# EAGLE design BC5 (EAGLE 7.2.0)
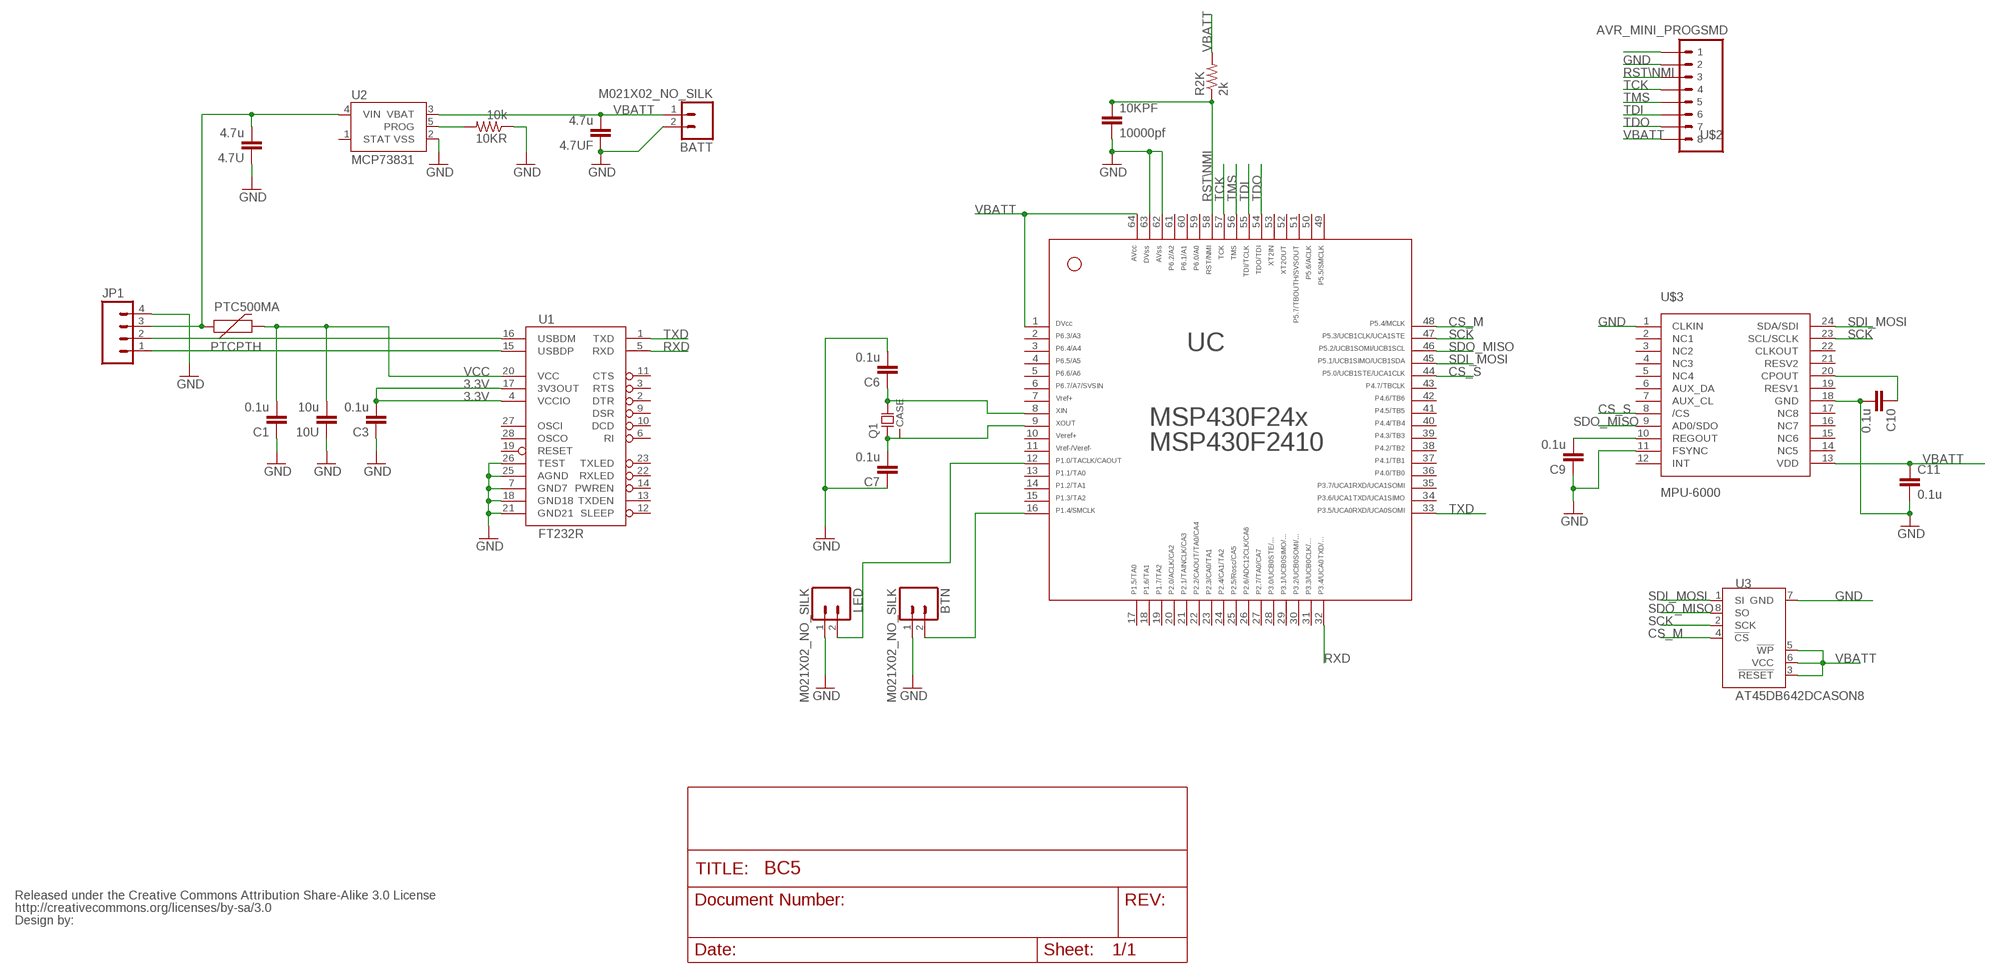
[diagram p0: schematic, sheet 1]

## Parts
4.7U  4.7u  CAP0402-CAP  [0402-CAP]
4.7UF  4.7u  CAP0402-CAP  [0402-CAP]
10KPF  10000pf  CAPEZ  [CAP-PTH-SMALLEZ]
10KR  10k  RESISTOR0402-RES  [0402-RES]
10U  10u  CAP0402-CAP  [0402-CAP]
BATT  M021X02_NO_SILK  [1X02_NO_SILK]
BTN  M021X02_NO_SILK  [1X02_NO_SILK]
C1  0.1u  CAP0402-CAP  [0402-CAP]
C3  0.1u  CAP0402-CAP  [0402-CAP]
C6  0.1u  CAP0402-CAP  [0402-CAP]
C7  0.1u  CAP0402-CAP  [0402-CAP]
C9  0.1u  CAP0402-CAP  [0402-CAP]
C10  0.1u  CAP0402-CAP  [0402-CAP]
C11  0.1u  CAP0402-CAP  [0402-CAP]
JP1  M04LOCK  [1X04_LOCK]
LED  M021X02_NO_SILK  [1X02_NO_SILK]
PTC500MA  PTCPTH  [PTC]
Q1  MS1V-T1K-32.768KHZ/12.5PF/20PPM/TA/QC  [MS1V-T1K]
R2K  2k  R-US_0204/5  [0204/5]
U1  FT232R  FT232RLSSOP  [SSOP28DB]
U2  MCP73831  [SOT23-5]
U3  AT45DB642DCASON8  [CASON8]
U$1  CREATIVE_COMMONS  [CREATIVE_COMMONS]
U$2  AVR_MINI_PROGSMD  [AVR_MINI_PROG]
U$3  MPU-6000  [QFN-24]
UC  F24[X/10]---PM64  [PM/PAG64]

## Nets
3.3V [power]: C3.2 U1.4(VCCIO) U1.17(3V3OUT)
5V: 4.7U.2 JP1.3 PTC500MA.P$1 U2.4(VIN)
BTN: BTN.2 UC.16
CS_M: U3.4(!CS) UC.48
CS_S: U$3.8(/CS) UC.44
GND [power]: 4.7U.1 4.7UF.1 10KPF.2 10KR.1 10U.1 BATT.2 BTN.1 C1.1 C3.1 C6.2 C7.1 C9.1 C10.2 C11.2 JP1.4 LED.1 U1.7(GND7) U1.18(GND18) U1.21(GND21) U1.25(AGND) U1.26(TEST) U2.2(VSS) U3.7(GND) U$2.2 U$3.1(CLKIN) U$3.11(FSYNC) U$3.18(GND) UC.62 UC.63
N$1: U$2.1
N$2: LED.2 UC.12
N$3: 10KR.2 U2.5(PROG)
N$4: C6.1 Q1.2 UC.8
N$5: C7.2 Q1.1 UC.9
N$6: C9.2 U$3.10(REGOUT)
N$7: C10.1 U$3.20(CPOUT)
RST\NMI: 10KPF.1 R2K.1 U$2.3 UC.58
RXD: U1.5(RXD) UC.32
SCK: U3.2(SCK) U$3.23(SCL/SCLK) UC.47
SDI_MOSI: U3.1(SI) U$3.24(SDA/SDI) UC.45
SDO_MISO: U3.8(SO) U$3.9(AD0/SDO) UC.46
TCK: U$2.4 UC.57
TDI: U$2.6 UC.55
TDO: U$2.7 UC.54
TMS: U$2.5 UC.56
TXD: U1.1(TXD) UC.33
USB_D+: JP1.1 U1.15(USBDP)
USB_D-: JP1.2 U1.16(USBDM)
VBATT: 4.7UF.2 BATT.1 C11.1 R2K.2 U2.3(VBAT) U3.3(!RESET) U3.5(!WP) U3.6(VCC) U$2.8 U$3.13(VDD) UC.1 UC.64
VCC [power]: 10U.2 C1.2 PTC500MA.P$2 U1.20(VCC)
Unconnected: Q1.CASE U1.2(DTR) U1.3(RTS) U1.6(RI) U1.9(DSR) U1.10(DCD) U1.11(CTS) U1.12(SLEEP) U1.13(TXDEN) U1.14(PWREN) U1.19(RESET) U1.22(RXLED) U1.23(TXLED) U1.27(OSCI) U1.28(OSCO) U2.1(STAT) U$3.2(NC1) U$3.3(NC2) U$3.4(NC3) U$3.5(NC4) U$3.6(AUX_DA) U$3.7(AUX_CL) U$3.12(INT) U$3.14(NC5) U$3.15(NC6) U$3.16(NC7) U$3.17(NC8) U$3.19(RESV1) U$3.21(RESV2) U$3.22(CLKOUT) UC.2 UC.3 UC.4 UC.5 UC.6 UC.7 UC.10 UC.11 UC.13 UC.14 UC.15 UC.17 UC.18 UC.19 UC.20 UC.21 UC.22 UC.23 UC.24 UC.25 UC.26 UC.27 UC.28 UC.29 UC.30 UC.31 UC.34 UC.35 UC.36 UC.37 UC.38 UC.39 UC.40 UC.41 UC.42 UC.43 UC.49 UC.50 UC.51 UC.52 UC.53 UC.59 UC.60 UC.61

## Library data of the parts
4.7U 4.7UF 10U C1 C3 C6 C7 C9-C11 = SparkFun-Capacitors:CAP: Capacitor Standard 0603 ceramic capacitor, and 0.1" leaded capacitor.
10KPF = SparkFun-Passives:CAP: Capacitor Standard 0603 ceramic capacitor, and 0.1" leaded capacitor.
10KR = SparkFun-Passives:RESISTOR: Resistor Basic schematic elements and footprints for 0603, 1206, and PTH resistors.
BATT BTN LED = SparkFun-Connectors:M02: Standard 2-pin 0.1" header. Use with - straight break away headers ( PRT-00116) - right angle break away headers (PRT-00553) - swiss pins (PRT-00743) - machine pins (PRT-00117) - female headers (PRT-00115) Molex polarized connector foot print use with: PRT-08233 with associated crimp pins and housings. 2.54_SCREWTERM for use with PRT-10571. 3.5mm Screw Terminal footprints for PRT-08084 5mm Screw Terminal footprints for use with PRT-08433
JP1 = SparkFun-Connectors:M04: Header 4 Standard 4-pin 0.1" header. Use with straight break away headers (SKU : PRT-00116), right angle break away headers (PRT-00553), swiss pins (PRT-00743), machine pins (PRT-00117), and female headers (PRT-00115). Molex polarized connector foot print use with SKU : PRT-08231 with associated crimp pins and housings. 1MM SMD Version SKU: PRT-10208
PTC500MA = SparkFun-PowerIC:PTC: Resettable Fuse PTC Resettable Fuse. Spark Fun Electronics SKU : COM-08357
Q1 = T1K:MS1V-T1K-*: p r e l i m i n a r y 5 . 0 . 0 MS1V-T1K Crystaly source: www.microcrystal.com
R2K = resistor:R-US_: RESISTOR, American symbol
U1 = SparkFun:FT232RL: USB UART FT232RL 4th Generation USB UART (USB <-> Serial) Controller. Spark Fun Electronics SKU : COM-00650
U2 = SparkFun-PowerIC:MCP73831: Miniature single cell, fully integrated Li-Ion, Li-polymer charge management controller http://ww1.microchip.com/downloads/en/DeviceDoc/21984a.pdf IC-09995; PROD_ID: IC-09995
U3 = SparkFun-DigitalIC:AT45DB642D: at45db642d memory CASON8 http://www.adestotech.com/at45db642d
U$1 = SparkFun:CREATIVE_COMMONS
U$2 = SparkFun-Connectors2:AVR_MINI_PROG: AVR ISP 6-pin inline header
U$3 = 3DRobotics_Master_Library:MPU-6000: Invensense MPU-6000: 3-axis gyro, 3-axis accel & 9-axis MotionFusion The MPU-60X0 Motion Processing Unit (MPU?) is the world?s first motion processing solution with integrated 9-axis sensor fusion for handset and tablet applications, game controllers, motion pointer remote controls, and other consumer devices. The MPU-60X0 has an embedded 3-axis MEMS gyroscope, 3-axis MEMS accelerometer and Digital Motion Processor? (DMP) hardware accelerator engine with an auxiliary I 2 C port that interfaces to third party digital sensors, such as magnetometers. Interfacing with a 3-axis magnetometer delivers a complete 9-axis sensor fusion output to the MPU?s primary I 2 C or SPI port. (SPI is available on MPU-6000 only). This combines acceleration and rotational motion plus heading information into a single data stream for the application; DATASHEET: http://invensense.com/mems/gyro/documents/PS-MPU-6000A-00_v1.0.pdf; LINK: http://invensense.com/mems/gyro/mpu6000.html; MFGPN: MPU-6000
UC = TI_MSP430_v16:F24[X/10]---PM64: ***MSP430F24[x/10]***PM64

## Net classes
0 default: width 0.203 mm
1 power: width 0.254 mm

## Board
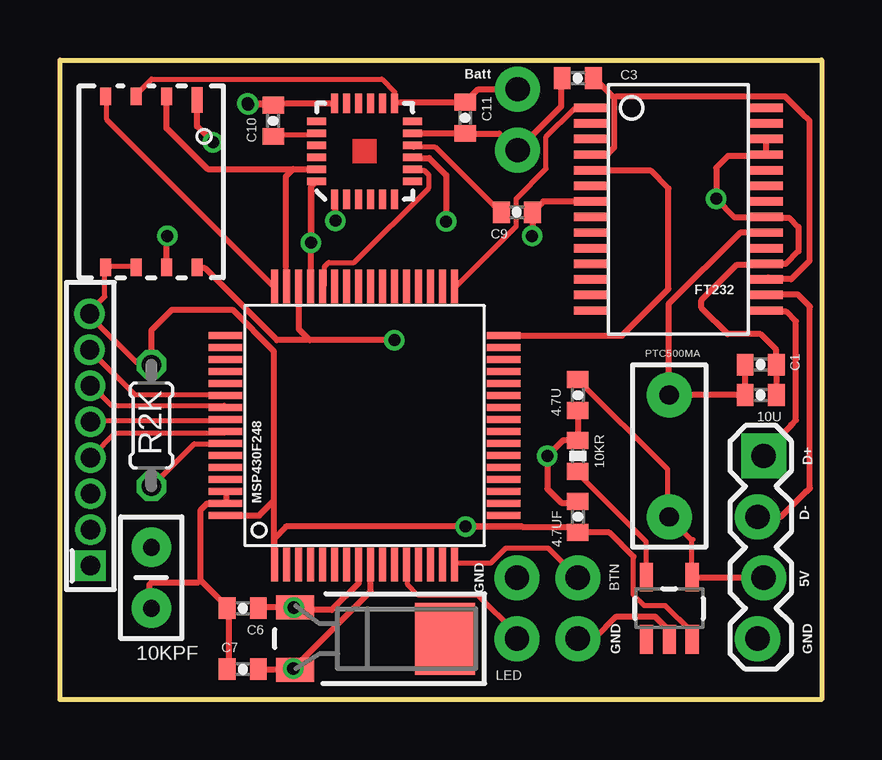
[diagram p1: board, top side]
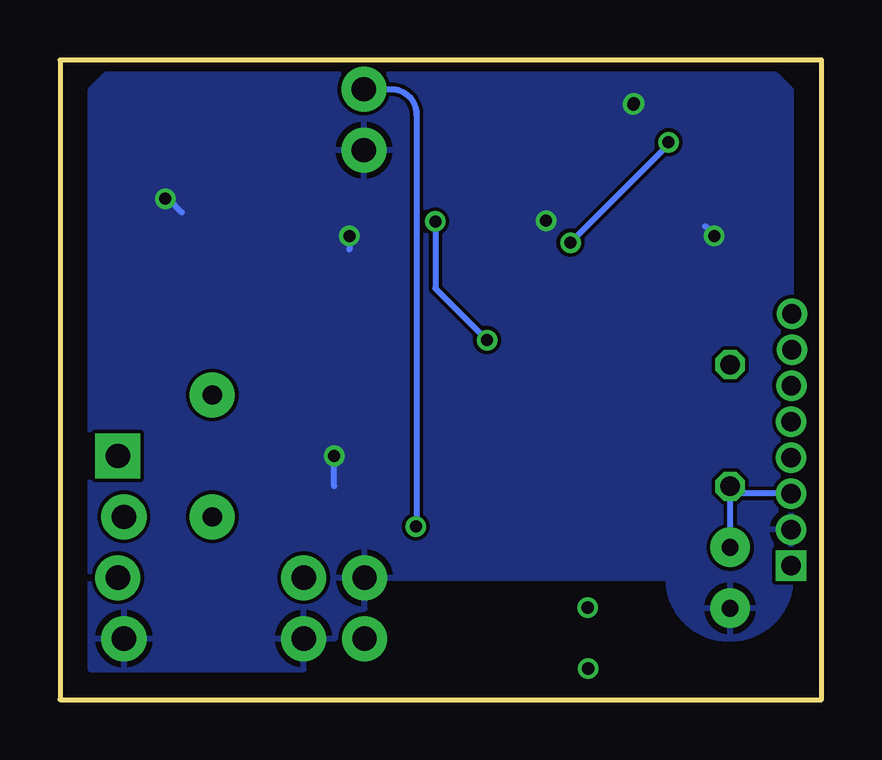
[diagram p2: board, bottom side, seen from below]

Size 31.75 x 26.67 mm. Coordinates in mm from the lower left corner, seen from the top.
Outline: 0,26.67 31.75,26.67 31.75,0 0,0 0,26.67
Copper layers (1*16): Top 0.0356mm / dielectric 1.5011mm / Bottom 0.0356mm
Design rules "LaenPCBOrder": minimum track width 6mil, minimum drill 13mil, track to track 6mil, track to pad 6mil, pad to pad 6mil, via to via 6mil, smd to smd 6mil, copper to edge 15mil, drill to drill 6mil, minimum pad ring 7mil, minimum via ring 7mil, stop-mask expansion 3mil, vias tented up to drill 0mil, thermal gap 10mil

### Footprints (pad centres in the part's own frame; a part is rotated, then mirrored left to right if it is on the bottom)
0402-CAP = smd 0.7 x 0.9: 1 -0.65,0; 2 0.65,0
CAP-PTH-SMALLEZ = drill 0.7 pad 1.651: 1 0,0; 2 2.54,0
0402-RES = smd 0.7 x 0.9: 1 -0.65,0; 2 0.65,0
1X02_NO_SILK = drill 1.016 pad 1.88: 1 0,0; 2 2.54,0
1X04_LOCK = drill 1.016 pad 1.88 square: 1 0,0.127 | drill 1.016 pad 1.88: 2 2.54,-0.127; 3 5.08,0.127; 4 7.62,-0.127
PTC = drill 0.8 pad 1.88: P$1 -2.54,0; P$2 2.54,0
MS1V-T1K = smd 1.6 x 1: 1 2.9,1.3; 2 2.9,-1.3 | smd 2.5 x 3: CASE -3.35,0
0204/5 = drill 0.813 octagon: 1 -2.54,0; 2 2.54,0
SSOP28DB = smd 0.348 x 1.397: 1 -4.225,-3.656; 2 -3.575,-3.656; 3 -2.925,-3.656; 4 -2.275,-3.656; 5 -1.625,-3.656; 6 -0.975,-3.656; 7 -0.325,-3.656; 8 0.325,-3.656; 9 0.975,-3.656; 10 1.625,-3.656; 11 2.275,-3.656; 12 2.925,-3.656; 13 3.575,-3.656; 14 4.225,-3.656; 15 4.225,3.656; 16 3.575,3.656; 17 2.925,3.656; 18 2.275,3.656; 19 1.625,3.656; 20 0.975,3.656; 21 0.325,3.656; 22 -0.325,3.656; 23 -0.975,3.656; 24 -1.625,3.656; 25 -2.275,3.656; 26 -2.925,3.656; 27 -3.575,3.656; 28 -4.225,3.656
SOT23-5 = smd 0.55 x 1.2: 1 -0.95,-1.3; 2 0,-1.3; 3 0.95,-1.3; 4 0.95,1.3; 5 -0.95,1.3
CASON8 = smd 1.067 x 0.451: 1 -3.415,1.905 | smd 0.737 x 0.451: 2 -3.565,0.635; 3 -3.565,-0.635; 4 -3.565,-1.905; 5 3.565,-1.905; 6 3.565,-0.635; 7 3.565,0.635; 8 3.565,1.905
AVR_MINI_PROG = drill 0.8 pad 1.27 square: 1 0,0 | drill 0.8 pad 1.27: 2 1.5,0; 3 3,0; 4 4.5,0; 5 6,0; 6 7.5,0.01; 7 8.999,0.035; 8 10.497,0.035
QFN-24 = smd 0.8 x 0.3: 1 -2,1.25; 2 -2,0.75; 3 -2,0.25; 4 -2,-0.25; 5 -2,-0.75; 6 -2,-1.25; 13 2,-1.25; 14 2,-0.75; 15 2,-0.25; 16 2,0.25; 17 2,0.75; 18 2,1.25 | smd 0.3 x 0.8: 7 -1.25,-2; 8 -0.75,-2; 9 -0.25,-2; 10 0.25,-2; 11 0.75,-2; 12 1.25,-2; 19 1.25,2; 20 0.75,2; 21 0.25,2; 22 -0.25,2; 23 -0.75,2; 24 -1.25,2
PM/PAG64 = smd 1.4 x 0.3: 1 -5.8,3.75; 2 -5.8,3.25; 3 -5.8,2.75; 4 -5.8,2.25; 5 -5.8,1.75; 6 -5.8,1.25; 7 -5.8,0.75; 8 -5.8,0.25; 9 -5.8,-0.25; 10 -5.8,-0.75; 11 -5.8,-1.25; 12 -5.8,-1.75; 13 -5.8,-2.25; 14 -5.8,-2.75; 15 -5.8,-3.25; 16 -5.8,-3.75; 33 5.8,-3.75; 34 5.8,-3.25; 35 5.8,-2.75; 36 5.8,-2.25; 37 5.8,-1.75; 38 5.8,-1.25; 39 5.8,-0.75; 40 5.8,-0.25; 41 5.8,0.25; 42 5.8,0.75; 43 5.8,1.25; 44 5.8,1.75; 45 5.8,2.25; 46 5.8,2.75; 47 5.8,3.25; 48 5.8,3.75 | smd 0.3 x 1.4: 17 -3.75,-5.8; 18 -3.25,-5.8; 19 -2.75,-5.8; 20 -2.25,-5.8; 21 -1.75,-5.8; 22 -1.25,-5.8; 23 -0.75,-5.8; 24 -0.25,-5.8; 25 0.25,-5.8; 26 0.75,-5.8; 27 1.25,-5.8; 28 1.75,-5.8; 29 2.25,-5.8; 30 2.75,-5.8; 31 3.25,-5.8; 32 3.75,-5.8; 49 3.75,5.8; 50 3.25,5.8; 51 2.75,5.8; 52 2.25,5.8; 53 1.75,5.8; 54 1.25,5.8; 55 0.75,5.8; 56 0.25,5.8; 57 -0.25,5.8; 58 -0.75,5.8; 59 -1.25,5.8; 60 -1.75,5.8; 61 -2.25,5.8; 62 -2.75,5.8; 63 -3.25,5.8; 64 -3.75,5.8

### Placement (x,y rotation side)
4.7U  21.59,12.7 90 top
4.7UF  21.59,7.62 270 top
10KPF  3.81,6.35 270 top
10KR  21.59,10.16 270 top
10U  29.21,12.7 180 top
BATT  19.08,25.45 270 top
BTN  21.59,2.54 90 top
C1  29.21,13.97 180 top
C3  21.59,25.91 0 top
C6  7.62,3.81 180 top
C7  7.62,1.27 0 top
C9  19.05,20.32 180 top
C10  8.89,24.13 90 top
C11  16.89,24.26 270 top
JP1  29.21,10.16 270 top
LED  19.05,5.08 270 top
PTC500MA  25.4,10.16 90 top
Q1  12.7,2.54 180 top
R2K  3.81,11.43 90 top
U1  25.78,20.45 270 top
U2  25.4,3.81 0 top
U3  3.81,21.59 270 top
U$1  0,0 0 top
U$2  1.27,5.59 90 top
U$3  12.7,22.86 90 top
UC  12.7,11.43 90 top

### Tracks (layer width: path | path; a pad name or v marks a point on that pad's centre or on a via)
3.3V
  Top 0.254: 23.11,25.07 22.31,25.87 C3.2 | 23.11,25.07 23.11,23.02 22.85,22.76 22.14,22.76 U1.4 | 29.52,17.6 U1.17 30.48,17.53 31.24,18.29 31.24,24.13 30.94,24.43 30.94,24.45 30.23,25.16 23.2,25.16 23.11,25.07
5V
  Top 0.203: 4.7U.2 21.6,13.34 25.34,9.6 25.34,7.64 PTC500MA.P$1 25.43,7.56 26.31,6.67 | 26.31,6.67 26.31,5.16 U2.4 | 26.4,6.67 26.31,6.67
  Top 0.254: JP1.3 26.38,5.08 U2.4
BTN
  Top 0.203: BTN.2 20.36,6.31 18.58,6.31 17.96,5.69 16.54,5.69 UC.16
CS_M
  Top 0.203: U3.4 1.96,25.07 1.96,24.18 8.89,17.25 UC.48
CS_S
  Top 0.203: U$3.8 14.76,22.05 15.2,22.05 15.38,21.87 15.38,21.34 12.27,18.22 11.2,18.22 11.02,18.05 11.02,17.25 UC.44
GND  (via drill 0.5 pad 0.25)
  Top 0.254: 21.6,2.58 BTN.1 | U2.2 25.34,2.58 25.34,2.93 24.8,3.47 23.2,3.47 22.28,2.54 BTN.1 | 19.11,5.07 LED.1 | 21.51,2.67 BTN.1 | UC.62 6.93,8.62 6.93,8.27 UC.63 6.84,8.18 6.13,8.18 5.87,7.91 5.87,4.98 | C7.1 7.02,1.33 7.02,3.73 C6.2 6.93,3.91 5.87,4.98 | 10KPF.2 3.73,3.82 3.73,4.8 3.82,4.89 5.78,4.89 5.87,4.98 | C3.1 20.89,25.87 20.89,24.73 BATT.2 19.05,22.89 19.05,22.86 18.3,23.61 C11.2 U$3.11 14.67,23.65 | U$3.1 11.47,20.89 11.47,19.98 v11.48,19.96 | 11.47,24.8 U$3.18 | C10.2 8.89,24.8 7.86,24.8 v7.85,24.82 | 11.38,24.8 U$3.18 | U1.26 29.43,23.29 29.43,22.76 U1.25 29.52,22.67 27.85,22.67 27.36,22.17 v27.36,20.88 28.12,20.12 U1.21 29.52,20.09 30.4,20.09 30.79,19.71 30.79,18.69 30.25,18.16 U1.18 | 29.52,18.22 U1.18 | 21.51,12.09 4.7U.1 21.6,12 21.6,10.85 10KR.1 20.97,10.81 v20.32,10.16 20.32,8.79 20.9,8.2 21.52,8.2 4.7UF.1 | U3.7 4.45,19.3 v4.47,19.33 | U1.7 20.15,20.77 C9.1 19.7,19.34 v19.68,19.33 | v7.82,24.87 U$3.18 | 29.43,18.16 U1.18 | U1.18 29.4,18.14 28.22,18.14 26.75,16.66 26.75,16.33 27.84,15.24 29.21,15.24 29.86,14.59 C1.1 10U.1
  Bottom 0.254: v4.47,19.33 4.47,19.36 4.85,19.74 | v11.48,19.96 11.63,19.96 | v7.85,24.82 7.85,24.84 v7.82,24.87 | v19.68,19.33 19.68,18.77 | v27.36,20.88 27.23,20.88 26.67,20.32 | 20.32,8.89 v20.32,10.16
  pour Bottom: 1.27,25.4 2.54,26.67 29.21,26.67 30.48,25.4 30.48,1.27 21.59,1.27 17.78,5.08 6.4,5.05 arc-90 3.89,2.54 3.81,2.54 arc-90 1.27,5.08
N$2
  Top 0.203: UC.12 14.49,5.6 14.49,4.8 14.94,4.36 17.42,4.36 19.02,2.76 19.02,2.58 LED.2
N$3
  Top 0.203: 10KR.2 21.6,9.42 24.45,6.58 24.45,5.16 U2.5
N$4
  Top 0.254: UC.8 12.45,4.86 11.33,3.73 9.91,3.73 Q1.2 8.3,3.84 C6.1
N$5
  Top 0.254: C7.2 9.77,1.27 Q1.1 9.8,1.37 12.95,4.52 UC.9
N$6
  Top 0.203: U$3.10 14.76,23.02 15.65,23.02 18.31,20.36 C9.2
N$7
  Top 0.203: U$3.20 10.67,23.56 8.89,23.56 C10.1
N$13  (via drill 0.51)
  other vias: 9.75,3.84
N$14  (via drill 0.51)
  other vias: 9.73,1.3
RST\NMI
  Top 0.203: UC.58 6.84,10.67 5.6,10.67 3.82,8.89 R2K.1
  Bottom 0.254: 10KPF.1 R2K.1 3.51,8.59 U$2.3
RXD
  Top 0.254: UC.32 23.43,15.18 25.38,17.12 25.38,21.31 24.64,22.05 22.15,22.05 U1.5
SCK
  Top 0.203: 9.42,18.05 9.42,17.25 UC.47
  Top 0.254: 9.42,18.05 9.42,21.82 9.73,22.12 | 9.73,22.12 10.69,22.12 U$3.23 | 9.73,22.12 6.15,22.12 4.45,23.82 U3.2
SDI_MOSI  (via drill 0.5 pad 0.25)
  Top 0.254: U$3.24 10.45,21.36 | 10.45,21.36 UC.45 | 10.45,21.36 10.46,21.34 v10.46,19.05 | v6.38,23.24 5.71,23.9 U3.1
  Bottom 0.254: v10.46,19.05 6.38,23.14 v6.38,23.24
SDO_MISO  (via drill 0.5 pad 0.25)
  Top 0.254: U$3.9 14.73,22.58 15.39,22.58 16.1,21.87 v16.1,19.94 | v13.95,14.99 10.41,14.99 | 10.41,14.99 9.04,14.99 6.04,17.98 5.76,17.98 U3.8 | UC.46 9.95,15.45 10.41,14.99
  Bottom 0.254: v16.1,19.94 16.1,17.14 v13.95,14.99
TCK
  Top 0.203: UC.57 6.84,11.11 2.31,11.11 1.33,10.13 U$2.4
TDI
  Top 0.203: UC.55 6.84,12.27 2.13,12.27 1.33,13.07 U$2.6
TDO
  Top 0.203: UC.54 6.84,12.71 3.11,12.71 1.25,14.58 U$2.7
TMS
  Top 0.203: UC.56 6.84,11.65 1.33,11.65 U$2.5
TXD
  Top 0.203: U1.1 22.05,24.62 21.43,24.62 20.27,23.47 20.27,22.14 19.02,20.89 19.02,19.74 16.54,17.25 UC.33
USB_D+
  Top 0.254: JP1.1 29.34,10.29 30.48,11.43 30.48,11.46 30.68,11.66 30.68,15.77 30.28,16.18 29.48,16.18 U1.15
USB_D-
  Top 0.254: JP1.2 30.05,7.62 31.09,8.66 31.11,8.66 31.27,8.81 31.27,16.38 30.76,16.89 29.46,16.89 U1.16
VBATT  (via drill 0.5 pad 0.25)
  Top 0.203: 13.96,24.89 U$3.13 13.96,24.98 13.96,25.34 13.42,25.87 3.82,25.87 3.2,25.25 U3.3 3.11,25.16 | 23.91,5.96 23.91,4.36 24.36,3.91 25.25,3.91 26.31,2.85 26.31,2.58 U2.3 | U3.5 1.96,18.05 3.11,18.05 U3.6 | 1.96,18.14 U3.5 | 6.93,7.64 UC.64 | 8.89,5.69 UC.1 | 3.82,14.05 R2K.2 3.73,14.05 3.2,14.05 1.25,16 U$2.8 1.25,16.18 1.87,16.8 1.87,17.96 U3.5
  Top 0.254: 16.84,24.86 C11.1 | 3.82,14.05 3.82,15.4 4.67,16.26 7.19,16.26 8.91,14.53 8.91,8.28 | 8.91,8.28 8.91,6.25 8.94,6.22 | 8.94,6.22 UC.1 | UC.64 8.31,7.67 8.91,8.28 | 8.94,6.22 8.94,6.73 9.42,7.21 v16.92,7.21 | 19.29,7.2 19.28,7.21 v16.92,7.21 | 19.29,7.2 v16.93,7.2 v16.92,7.21 | C11.1 17.43,25.45 BATT.1 | 13.96,24.89 13.97,24.91 C11.1 | 19.29,7.2 21.36,7.2 arc-90 4.7UF.2 22.9,6.97 23.91,5.96
  Bottom 0.254: v16.92,7.21 16.89,7.24 16.89,24.41 arc-90 17.93,25.45 BATT.1
VCC
  Top 0.254: U1.20 28.36,19.47 25.38,16.48 25.38,12.72 PTC500MA.P$2 10U.2 C1.2

### Text on the board
tNames: Batt | FT232 | D+ | MSP430F248 | D- | GND | 5V | GND | GND